# Altium schematic sheet 13 LCD Backlight, Touchscreen.SchDoc
size B; DocumentNumber: 13; SheetNumber: 13; SheetTotal: 17
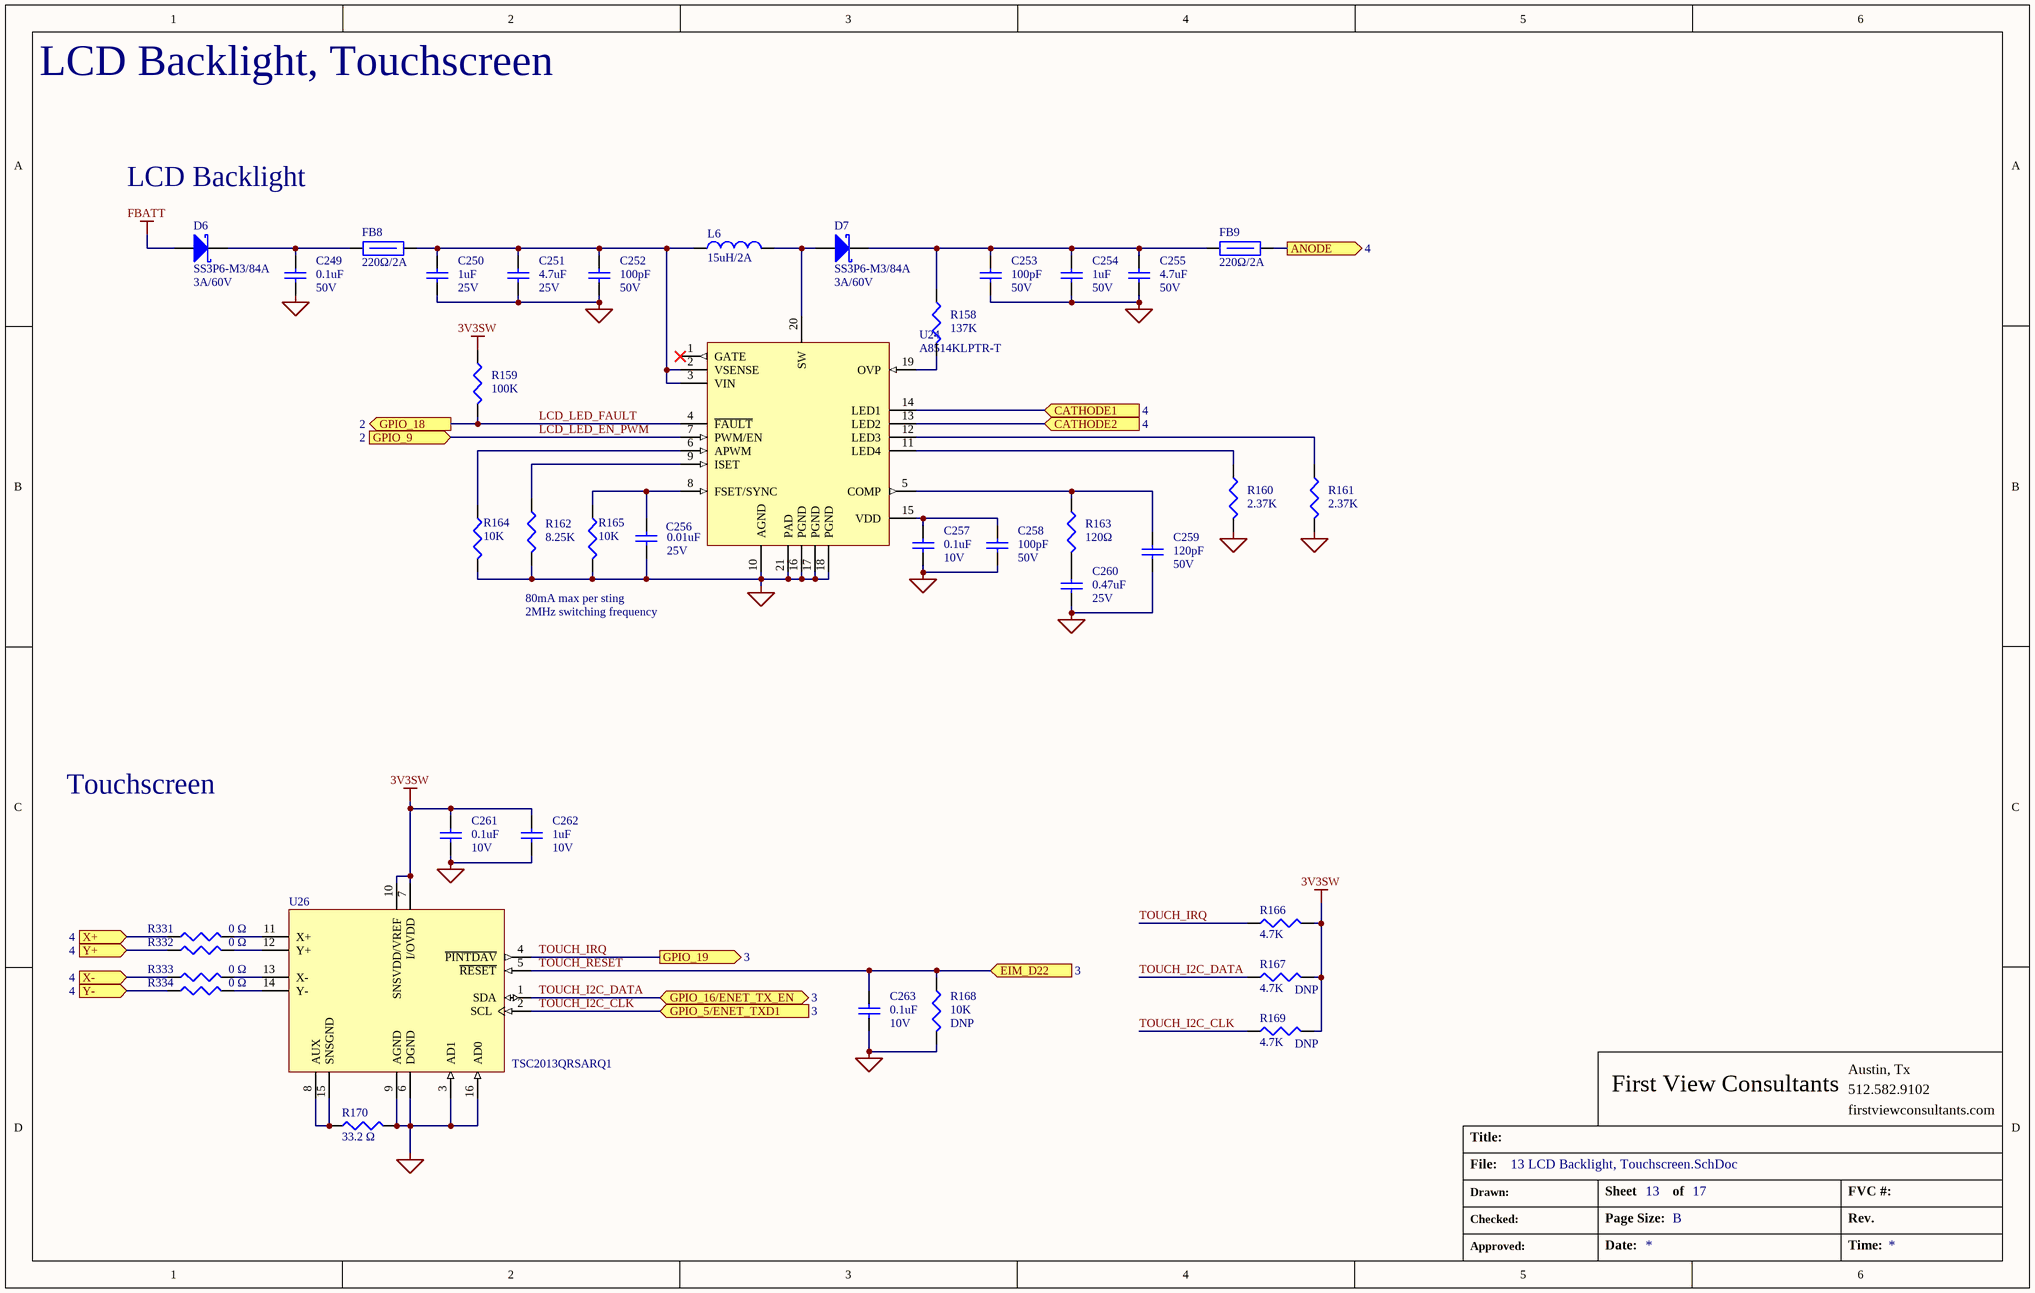
[diagram p0: 13 LCD Backlight, Touchscreen.SchDoc]

## Parts
C249  value 0.1uF  Voltage: 50V  [CAP_0402]  (hidden comment: Cap 0.1uF 50V 0402)
C250  value 1uF  Voltage: 25V  [CAP_0402]  (hidden comment: Cap 1uF 25V 0402)
C251  value 4.7uF  Voltage: 25V  [CAP_0805]  (hidden comment: Cap 4.7uF 25V 0805)
C252  value 100pF  Voltage: 50V  [CAP_0402]  (hidden comment: Cap 100pF 50V 0402)
C253  value 100pF  Voltage: 50V  [CAP_0402]  (hidden comment: Cap 100pF 50V 0402)
C254  value 1uF  Voltage: 50V  [CAP_1206]  (hidden comment: Cap 1uF 50V 1206)
C255  value 4.7uF  Voltage: 50V  [CAP_1206]  (hidden comment: Cap 4.7uF 50V 1206)
C256  value 0.01uF  Voltage: 25V  [CAP_0402]  (hidden comment: Cap 0.01uF 50V 0402)
C257  value 0.1uF  Voltage: 10V  [CAP_0402]  (hidden comment: Cap 0.1uF 10V 0402)
C258  value 100pF  Voltage: 50V  [CAP_0402]  (hidden comment: Cap 100pF 50V 0402)
C259  value 120pF  Voltage: 50V  [CAP_0402]  (hidden comment: Cap 120pF 50V 0402)
C260  value 0.47uF  Voltage: 25V  [CAP_0603]  (hidden comment: Cap 0.47uF 25V 0603)
C261  value 0.1uF  Voltage: 10V  [CAP_0402]  (hidden comment: Cap 0.1uF 10V 0402)
C262  value 1uF  Voltage: 10V  [CAP_0402]  (hidden comment: Cap 1uF 10V 0402)
C263  value 0.1uF  Voltage: 10V  [CAP_0402]  (hidden comment: Cap 0.1uF 10V 0402)
D6  SS3P6-M3/84A  value 3A/60V  [DO-220AA_SS3P6-M3/84A]
D7  SS3P6-M3/84A  value 3A/60V  [DO-220AA_SS3P6-M3/84A]
FB8  value 220Ω/2A  [IND_0805]  (hidden comment: BKP2125HS221-T)
FB9  value 220Ω/2A  [IND_0805]  (hidden comment: BKP2125HS221-T)
L6  value 15uH/2A  [IND_NRS8030T150MJGJ]  (hidden comment: NRS8030T150MJGJ)
R158  value 137K  [RES_0402]  (hidden comment: Res 137K 0.1W)
R159  value 100K  [RES_0402]  (hidden comment: Res 100K 0.1W)
R160  value 2.37K  [RES_0402]  (hidden comment: Res 2.37K 0.063W)
R161  value 2.37K  [RES_0402]  (hidden comment: Res 2.37K 0.063W)
R162  value 8.25K  [RES_0402]  (hidden comment: Res 8.25K 0.063W)
R163  value 120Ω  [RES_0402]  (hidden comment: Res 120R 0.063W)
R164  value 10K  [RES_0402]  (hidden comment: Res 10K 0.063W)
R165  value 10K  [RES_0402]  (hidden comment: Res 10K 0.063W)
R166  value 4.7K  [RES_0402]  (hidden comment: Res 4.7K 0.063W)
R167  value 4.7K  [RES_0402]  (hidden comment: Res 4.7K 0.063W)
R168  value 10K  [RES_0402]  (hidden comment: Res 10K 0.063W)
R169  value 4.7K  [RES_0402]  (hidden comment: Res 4.7K 0.063W)
R170  value 33.2 Ω  [RES_0402]  (hidden comment: Res 33.2R 0.063W)
R331  value 0 Ω  [RES_0402]  (hidden comment: Res 0 ohm 0.1W)
R332  value 0 Ω  [RES_0402]  (hidden comment: Res 0 ohm 0.1W)
R333  value 0 Ω  [RES_0402]  (hidden comment: Res 0 ohm 0.1W)
R334  value 0 Ω  [RES_0402]  (hidden comment: Res 0 ohm 0.1W)
U24  A8514KLPTR-T  [TSSOP-20_A8514KLPTR-T]
U26  TSC2013QRSARQ1  [QFN-16_TSC2013QRSARQ1]

## Ports
ANODE (out, see 4), CATHODE1 (in, see 4), CATHODE2 (in, see 4), EIM_D22 (in, see 3), GPIO_5/ENET_TXD1 (in, see 3), GPIO_9 (in, see 2), GPIO_16/ENET_TX_EN (bidir, see 3), GPIO_18 (out, see 2), GPIO_19 (out, see 3), X+ (in, see 4), X- (in, see 4), Y+ (in, see 4), Y- (in, see 4)

## Nets
3V3SW: C261.1 C262.1 R159.1 R166.2 R167.2 R169.2 U26.7(I/OVDD) U26.10(SNSVDD/VREF)
FBATT: D6.A
GND: C249.2 C250.2 C251.2 C252.2 C253.2 C254.2 C255.2 C256.2 C257.2 C258.2 C259.2 C260.2 C261.2 C262.2 C263.2 R160.2 R161.2 R162.2 R164.2 R165.2 R168.2 R170.2 U24.10(AGND) U24.16(PGND) U24.17(PGND) U24.18(PGND) U24.21(PAD) U26.3(AD1) U26.6(DGND) U26.9(AGND) U26.16(AD0)
ANODE: FB9.2 ; port ANODE
CATHODE1: U24.14(LED1) ; port CATHODE1
CATHODE2: U24.13(LED2) ; port CATHODE2
LCD_LED_EN_PWM: U24.7(PWM/EN) ; port GPIO_9
LCD_LED_FAULT: R159.2 U24.4(~{FAULT}) ; port GPIO_18
TOUCH_I2C_CLK: R169.1 U26.2(SCL) ; port GPIO_5/ENET_TXD1
TOUCH_I2C_DATA: R167.1 U26.1(SDA) ; port GPIO_16/ENET_TX_EN
TOUCH_IRQ: R166.1 U26.4(~{PINTDAV}) ; port GPIO_19
TOUCH_RESET: C263.1 R168.1 U26.5(~{RESET}) ; port EIM_D22
X+: R331.1 ; port X+
X-: R333.1 ; port X-
Y+: R332.1 ; port Y+
Y-: R334.1 ; port Y-
NetC249_1: C249.1 D6.K FB8.1
NetC250_1: C250.1 C251.1 C252.1 FB8.2 L6.1 U24.2(VSENSE) U24.3(VIN)
NetC253_1: C253.1 C254.1 C255.1 D7.K FB9.1 R158.1
NetC256_1: C256.1 R165.1 U24.8(FSET/SYNC)
NetC257_1: C257.1 C258.1 U24.15(VDD)
NetC259_1: C259.1 R163.1 U24.5(COMP)
NetC260_1: C260.1 R163.2
NetD7_A: D7.A L6.2 U24.20(SW)
NetR158_2: R158.2 U24.19(OVP)
NetR160_1: R160.1 U24.11(LED4)
NetR161_1: R161.1 U24.12(LED3)
NetR162_1: R162.1 U24.9(ISET)
NetR164_1: R164.1 U24.6(APWM)
NetR170_1: R170.1 U26.8(AUX) U26.15(SNSGND)
NetR331_2: R331.2 U26.11(X+)
NetR332_2: R332.2 U26.12(Y+)
NetR333_2: R333.2 U26.13(X-)
NetR334_2: R334.2 U26.14(Y-)

Not connected (* = marked no-connect by the designer): U24 1(GATE)*

## Notes on the sheet
- LCD Backlight, Touchscreen
- LCD Backlight
- 80mA max per sting
- 2MHz switching frequency
- Touchscreen
- First View Consultants
- Austin, Tx
- 512.582.9102
- Title:
- File:
- firstviewconsultants.com
- Drawn:
- Checked:
- Sheet
- Page Size:
- of
- B
- FVC #:
- Rev.
- Approved:
- Date:
- Time:

## Library data of the parts
C249 = Cap 0.1uF 50V 0402: Cap, Cer, 0.1uF, 50V, 10%, X5R, 0402; Manufacturer #: C1005X5R1H104K; Manufacturer: TDK Corporation; Have Footprint: yes; Tolerance: ±10%; Package: 0402
C250 = Cap 1uF 25V 0402: Cap, Cer, 1uF, 25V, 10%, X5R, 0402; Manufacturer #: TMK105BJ105MV-F; Manufacturer: Taiyo Yuden; Have Footprint: yes; Package: 0402
C251 = Cap 4.7uF 25V 0805: Cap, Cer, 4.7uF, 25V, 10%, X5R, 0805; Manufacturer: Murata Electronics North America; Manufacturer #: GRM21BR61E475KA12K; Have Footprint: yes; Tolerance: 10%; PACKAGE: 0805
C252 C253 C258 = Cap 100pF 50V 0402: Cap, Cer, 100pF, 50V, 5%, C0G/NP0, 0402; Manufacturer: Yageo; Manufacturer #: CC0402JRNPO9BN101; Have Footprint: yes; Tolerance: 5%; PACKAGE: 0402
C254 = Cap 1uF 50V 1206: Cap, Cer, 1uF, 50V, 10%, X7R, 1206; Manufacturer #: GRM31MR71H105KA88K; Manufacturer: Murata Electronics North America; Have Footprint: yes; Package: 1206; Operating Temperature: -55°C ~ 125°C
C255 = Cap 4.7uF 50V 1206: Cap, Cer, 4.7uF, 50V, 10%, X7R, 1206; Manufacturer: Taiyo Yuden; Manufacturer #: UMK316AB7475KL-T; Have Footprint: yes; Tolerance: 10%; PACKAGE: 1206
C256 = Cap 0.01uF 50V 0402: Cap, Cer, 0.01uF, 25V, ±10%, X7R, 0402; Manufacturer #: GRM155R71E103KA01J; Manufacturer: Murata; Have Footprint: yes; Tolerance: ±10%; Package: 0402
C257 C261 C263 = Cap 0.1uF 10V 0402: Cap, Cer, 0.1uF, 10V, 10%, X5R, 0402; Manufacturer: Murata Electronics North America; Manufacturer #: GRM155R61A104KA01J; Have Footprint: yes; Tolerance: ±10%; PACKAGE: 0402
C259 = Cap 120pF 50V 0402: Cap, Cer, 120pF, 50V, 5%, C0G/NP0, 0402; Manufacturer: Taiyo Yuden; Manufacturer #: UMK105CG121JV-F; Have Footprint: yes; Tolerance: 5%; PACKAGE: 0402
C260 = Cap 0.47uF 25V 0603: Cap, Cer, 0.47uF, 25V, 10%, X7R, 0603; Manufacturer: Samsung Electro-Mechanics America, Inc; Manufacturer #: CL10B474KA8NFNC; Have Footprint: yes; Package: 0603; Tolerance: 10%
C262 = Cap 1uF 10V 0402: Cap, Cer, 1uF, 10V, ±10%, X5R, 0402; Manufacturer #: CC0402KRX5R6BB105; Manufacturer: Yageo; Have Footprint: yes; Package: 0402
D6 D7 = SS3P6-M3/84A: Diode, Schottky, 3A, 60V, DO-220AA; Manufacturer: Vishay; Package: DO-220AA; Manufacturer #: SS3P6-M3/84A
FB8 FB9 = BKP2125HS221-T: Ind, Ferrite Bead, 220R, 50mOhm, 2A, 0805; Manufacturer: Taiyo Yuden; Manufacturer #: BKP2125HS221-T; Package: 0805
L6 = NRS8030T150MJGJ: Ind, Power, 15uH, 2A, 78mOhms, Shielded, SMD; Manufacturer: Taiyo Yuden; Operating Temperature: 25°C ~ 125°C; Package: SMD (8x8); Manufacturer #: NRS8030T150MJGJ
R158 = Res 137K 0.1W: Res, 137K, 0.1W, 1%, 0402; Manufacturer #: ERJ-2RKF1373X; Manufacturer: Panasonic Electronic Components; Have Footprint: yes; Package: 0402
R159 = Res 100K 0.1W: Res, 100K, 0.1W, 1%, 0402; Manufacturer #: ERJ-2RKF1003X; Manufacturer: Panasonic Electronic Components; Have Footprint: yes; Package: 0402
R160 R161 = Res 2.37K 0.063W: Res, 2.37K, 0.063W, 1%, 0402; Manufacturer #: RC0402FR-072K37L; Manufacturer: Yageo; Have Footprint: yes; Package: 0402
R162 = Res 8.25K 0.063W: Res, 8.25K, 0.063W, 1%, 0402; Manufacturer #: RC0402FR-078K25L; Manufacturer: Yageo; Have Footprint: yes; Package: 0402
R163 = Res 120R 0.063W: Res, 120R, 0.063W, 1%, 0402; Manufacturer #: MCR01MRTF1200; Manufacturer: Rohm Semiconductor; Have Footprint: yes; Package: 0402
R164 R165 R168 = Res 10K 0.063W: Res, 10K, 1/16W, 1%, 0402; Manufacturer #: RC0402FR-0710KL; Manufacturer: Yageo; Have Footprint: yes; Package: 0402
  R168: DNP: DNP
R166 R167 R169 = Res 4.7K 0.063W: Res, 4.70K, 0.063W, 1%, 0402; Manufacturer #: CRCW04024K70FKED; Manufacturer: Vishay Dale; Have Footprint: yes; Package: 0402
  R167 R169: DNP: DNP
R170 = Res 33.2R 0.063W: Res, 33.2R, 0.063W, 1%, 0402; Manufacturer #: RC0402FR-0733R2L; Manufacturer: Yageo; Have Footprint: yes; Package: 0402
R331-R334 = Res 0 ohm 0.1W: Res, 0 ohm, 1/16W, 0402; Manufacturer #: CRCW04020000Z0ED; Manufacturer: Vishay Dale; Have Footprint: yes; Package: 0402
U24 = A8514KLPTR-T: IC, LED Driver, 5-40V, PWM 580k-2.3MHz, TSSOP-20; Manufacturer: Allegro; Have Footprint: yes; RoHS: yes; Manufacturer #: A8514KLPTR-T
U26 = TSC2013QRSARQ1: IC, TS Controller, I2C, 12-bit, 4-wire, 1.6-3.6V, QFN-16; Manufacturer: Texas Instruments; Manufacturer #: TSC2013QRSARQ1